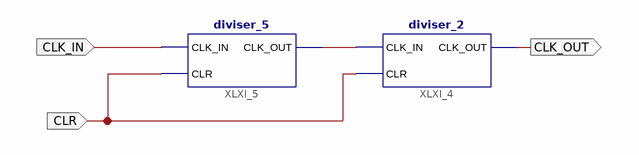
[diagram p0: schematic sheet 1]
// Xilinx ISE schematic diviser_10.sch (spartan6) as structural Verilog: 2 symbols, 3 ports
module diviser_10 (
  input  CLK_IN,
  input  CLR,
  output CLK_OUT
);

  wire XLXN_3;

  diviser_5 XLXI_5 (.CLK_IN(CLK_IN), .CLK_OUT(XLXN_3), .CLR(CLR));
  diviser_2 XLXI_4 (.CLK_IN(XLXN_3), .CLK_OUT(CLK_OUT), .CLR(CLR));
endmodule
